# Altium schematic sheet 06-LevelShifter.SchDoc
size A3; SheetNumber: 6; SheetTotal: 6
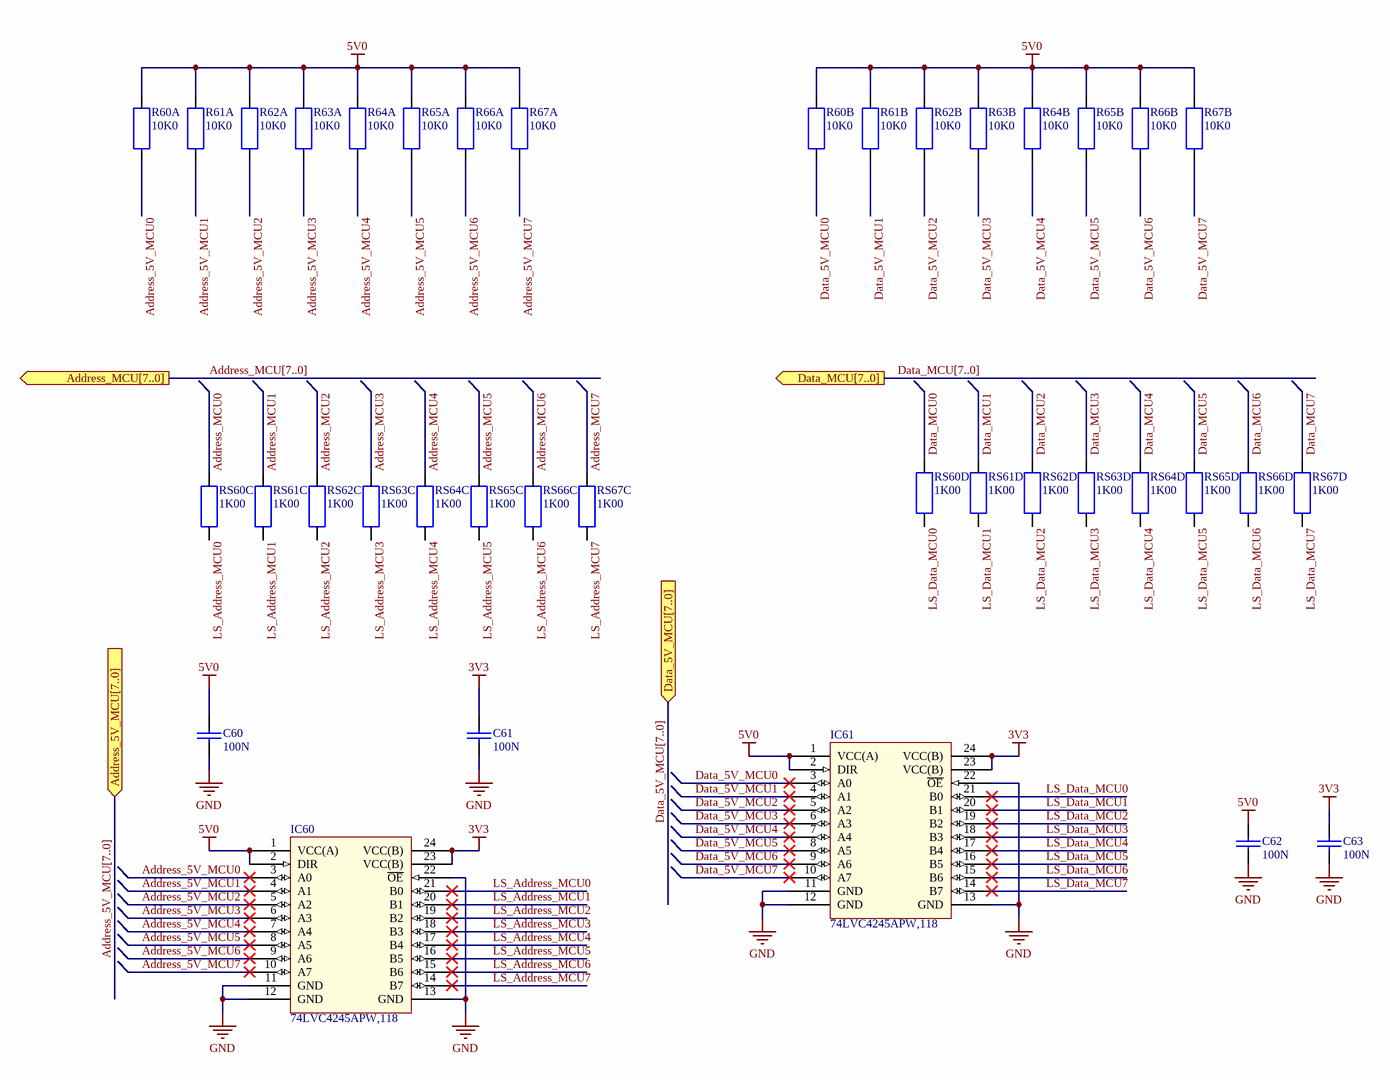
[diagram p0: 06-LevelShifter.SchDoc]

## Parts
C60  capacitance: 100N  [0603_C]  (hidden comment: CC)
C61  capacitance: 100N  [0603_C]  (hidden comment: CC)
C62  capacitance: 100N  [0603_C]  (hidden comment: CC)
C63  capacitance: 100N  [0603_C]  (hidden comment: CC)
IC60  entity_name: 74LVC4245APW,118  [TSSOP24]  (hidden comment: IC_74LVC4245APW118_TSSOP24)
IC61  entity_name: 74LVC4245APW,118  [TSSOP24]  (hidden comment: IC_74LVC4245APW118_TSSOP24)
R60A  resistance: 10K0  [0603_A]  (hidden comment: RS)
R60B  resistance: 10K0  [0603_A]  (hidden comment: RS)
R61A  resistance: 10K0  [0603_A]  (hidden comment: RS)
R61B  resistance: 10K0  [0603_A]  (hidden comment: RS)
R62A  resistance: 10K0  [0603_A]  (hidden comment: RS)
R62B  resistance: 10K0  [0603_A]  (hidden comment: RS)
R63A  resistance: 10K0  [0603_A]  (hidden comment: RS)
R63B  resistance: 10K0  [0603_A]  (hidden comment: RS)
R64A  resistance: 10K0  [0603_A]  (hidden comment: RS)
R64B  resistance: 10K0  [0603_A]  (hidden comment: RS)
R65A  resistance: 10K0  [0603_A]  (hidden comment: RS)
R65B  resistance: 10K0  [0603_A]  (hidden comment: RS)
R66A  resistance: 10K0  [0603_A]  (hidden comment: RS)
R66B  resistance: 10K0  [0603_A]  (hidden comment: RS)
R67A  resistance: 10K0  [0603_A]  (hidden comment: RS)
R67B  resistance: 10K0  [0603_A]  (hidden comment: RS)
RS60C  resistance: 1K00  [0603_A]  (hidden comment: RS)
RS60D  resistance: 1K00  [0603_A]  (hidden comment: RS)
RS61C  resistance: 1K00  [0603_A]  (hidden comment: RS)
RS61D  resistance: 1K00  [0603_A]  (hidden comment: RS)
RS62C  resistance: 1K00  [0603_A]  (hidden comment: RS)
RS62D  resistance: 1K00  [0603_A]  (hidden comment: RS)
RS63C  resistance: 1K00  [0603_A]  (hidden comment: RS)
RS63D  resistance: 1K00  [0603_A]  (hidden comment: RS)
RS64C  resistance: 1K00  [0603_A]  (hidden comment: RS)
RS64D  resistance: 1K00  [0603_A]  (hidden comment: RS)
RS65C  resistance: 1K00  [0603_A]  (hidden comment: RS)
RS65D  resistance: 1K00  [0603_A]  (hidden comment: RS)
RS66C  resistance: 1K00  [0603_A]  (hidden comment: RS)
RS66D  resistance: 1K00  [0603_A]  (hidden comment: RS)
RS67C  resistance: 1K00  [0603_A]  (hidden comment: RS)
RS67D  resistance: 1K00  [0603_A]  (hidden comment: RS)

## Ports
Address_5V_MCU[7..0] (in), Address_MCU[7..0] (out), Data_5V_MCU[7..0] (in), Data_MCU[7..0] (out)

## Nets
3V3: C61.1 C63.1 IC60.23(VCC(B)) IC60.24(VCC(B)) IC61.23(VCC(B)) IC61.24(VCC(B))
5V0: C60.1 C62.1 IC60.1(VCC(A)) IC60.2(DIR) IC61.1(VCC(A)) IC61.2(DIR) R60A.2 R60B.2 R61A.2 R61B.2 R62A.2 R62B.2 R63A.2 R63B.2 R64A.2 R64B.2 R65A.2 R65B.2 R66A.2 R66B.2 R67A.2 R67B.2
GND: C60.2 C61.2 C62.2 C63.2 IC60.11(GND) IC60.12(GND) IC60.13(GND) IC60.22(~{OE}) IC61.11(GND) IC61.12(GND) IC61.13(GND) IC61.22(~{OE})
Address_5V_MCU0: IC60.3(A0) R60A.1
Address_5V_MCU1: IC60.4(A1) R61A.1
Address_5V_MCU2: IC60.5(A2) R62A.1
Address_5V_MCU3: IC60.6(A3) R63A.1
Address_5V_MCU4: IC60.7(A4) R64A.1
Address_5V_MCU5: IC60.8(A5) R65A.1
Address_5V_MCU6: IC60.9(A6) R66A.1
Address_5V_MCU7: IC60.10(A7) R67A.1
Address_MCU0: RS60C.2
Address_MCU1: RS61C.2
Address_MCU2: RS62C.2
Address_MCU3: RS63C.2
Address_MCU4: RS64C.2
Address_MCU5: RS65C.2
Address_MCU6: RS66C.2
Address_MCU7: RS67C.2
Data_5V_MCU0: IC61.3(A0) R60B.1
Data_5V_MCU1: IC61.4(A1) R61B.1
Data_5V_MCU2: IC61.5(A2) R62B.1
Data_5V_MCU3: IC61.6(A3) R63B.1
Data_5V_MCU4: IC61.7(A4) R64B.1
Data_5V_MCU5: IC61.8(A5) R65B.1
Data_5V_MCU6: IC61.9(A6) R66B.1
Data_5V_MCU7: IC61.10(A7) R67B.1
Data_MCU0: RS60D.2
Data_MCU1: RS61D.2
Data_MCU2: RS62D.2
Data_MCU3: RS63D.2
Data_MCU4: RS64D.2
Data_MCU5: RS65D.2
Data_MCU6: RS66D.2
Data_MCU7: RS67D.2
LS_Address_MCU0: IC60.21(B0) RS60C.1
LS_Address_MCU1: IC60.20(B1) RS61C.1
LS_Address_MCU2: IC60.19(B2) RS62C.1
LS_Address_MCU3: IC60.18(B3) RS63C.1
LS_Address_MCU4: IC60.17(B4) RS64C.1
LS_Address_MCU5: IC60.16(B5) RS65C.1
LS_Address_MCU6: IC60.15(B6) RS66C.1
LS_Address_MCU7: IC60.14(B7) RS67C.1
LS_Data_MCU0: IC61.21(B0) RS60D.1
LS_Data_MCU1: IC61.20(B1) RS61D.1
LS_Data_MCU2: IC61.19(B2) RS62D.1
LS_Data_MCU3: IC61.18(B3) RS63D.1
LS_Data_MCU4: IC61.17(B4) RS64D.1
LS_Data_MCU5: IC61.16(B5) RS65D.1
LS_Data_MCU6: IC61.15(B6) RS66D.1
LS_Data_MCU7: IC61.14(B7) RS67D.1

## Buses and harness runs
bus Address_5V_MCU[7..0] = port Address_5V_MCU[7..0]
bus Address_MCU[7..0] =  = port Address_MCU[7..0]
bus Data_5V_MCU[7..0] = port Data_5V_MCU[7..0]
bus Data_MCU[7..0] =  = port Data_MCU[7..0]

## Notes on the sheet
- Title:
- Date:
- SVN:
- Ver:
- Sheet Size:
- A3
- Sheet Name:
- OF
- Checked By:
- Drawn By:
- Damian Szczypior
- Rev:
- Alle Rechte vorbehalten. Kopien ohne Erlaubnis der X2E GmbH sind nicht gestattet. Dieses Dokument darf ohne die Erlaubnis der X2E GmbH nicht an Dritte (auch nicht in Auszügen) weitergegeben werden .
- Sheet:

## Library data of the parts
C60-C63 = X_00004988: manufacturer: Kemet; entity_name: CC_0603_100N_50V0_10P0_X7R_Kemet; entity_type_name: capacitor_ceramic; temp_coefficient: X7R; release: blocked; max_operating_temp: 125C; min_operating_temp: -55C; tolerance: 10P0; voltage_rated: 50V0; ordering_information_btm: 801-5347; used_in_bom: 0; production_status: Aktiv; x2e_number: X_00004988; height: mm800; width: mm800; length: 1mm60; package: 0603; series: none
IC60 IC61 = IC_74LVC4245APW118_TSSOP24: ic, logic, bus switch, level shifter; manufacturer: IDT; manufacture_name: IDTQS3384QG8; ordering_information: digikey, 800-1739-1-ND; x2e_number: X_00000794; propagation_delay: 250P; data_rate: bps000; number_of_channels: 001; release: blocked; number_of_bits: 010; max_operating_temp: 85C; min_operating_temp: -40C; vcc_max: 5V25; vcc_min: 4V75; ordering_information_btm: 800-1739-2-ND; used_in_bom: 1; production_status: Aktiv; entity_type_name: levelshifter; output_type: logic; input_type: logic; height: 1mm73; width: 3mm90; length: 8mm89; series: none; package: SSOP24; revision: none
R60A R60B R61A R61B R62A R62B R63A R63B R64A R64B R65A R65B R66A R66B R67A R67B = X_00000001: manufacturer: Yageo; entity_name: RS_0603_10K0_W100_1P00_100PPM; entity_type_name: resistor_standard; power: W100; temp_coefficient: 100PPM; tolerance: 1P00; release: blocked; max_operating_temp: 125C; min_operating_temp: -55C; ordering_information_btm: 311-10.0KHRCT-ND; used_in_bom: 1; production_status: Aktiv; x2e_number: X_00000001; series: RC0603; height: mm450; width: mm800; length: 1mm60; package: 0603
RS60C RS60D RS61C RS61D RS62C RS62D RS63C RS63D RS64C RS64D RS65C RS65D RS66C RS66D RS67C RS67D = X_00000034: manufacturer: Yageo; entity_name: RS_0603_1K00_W100_1P00_100PPM; entity_type_name: resistor_standard; power: W100; temp_coefficient: 100PPM; tolerance: 1P00; release: blocked; max_operating_temp: 125C; min_operating_temp: -55C; ordering_information_btm: 504-8928; used_in_bom: 1; production_status: Aktiv; x2e_number: X_00000034; series: RC0603; height: mm450; width: mm800; length: 1mm60; package: 0603